# Altium schematic sheet FPGA_0.SchDoc
size A2; Date: Date; CompanyName: HESSO; Engineer: Name; Address1: Route du Rawyl 47; Address2: 1950 Sion; Address3: Switzerland; ProjectName: Project Name
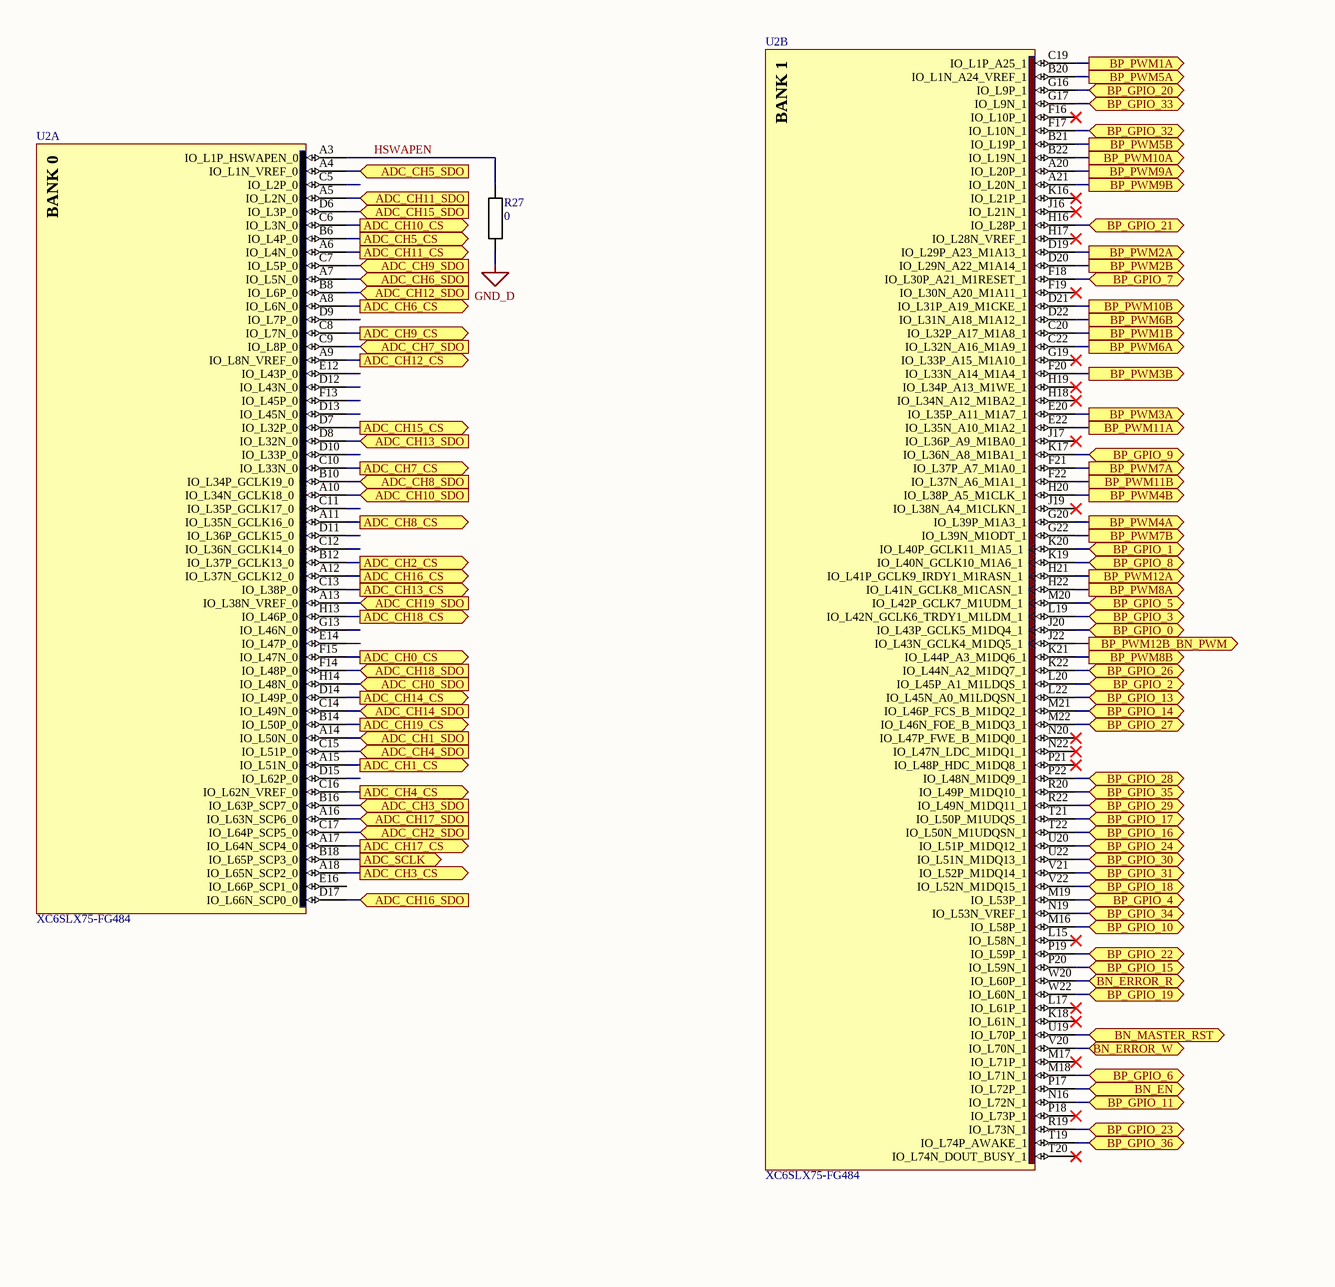
[diagram p0: FPGA_0.SchDoc, left]
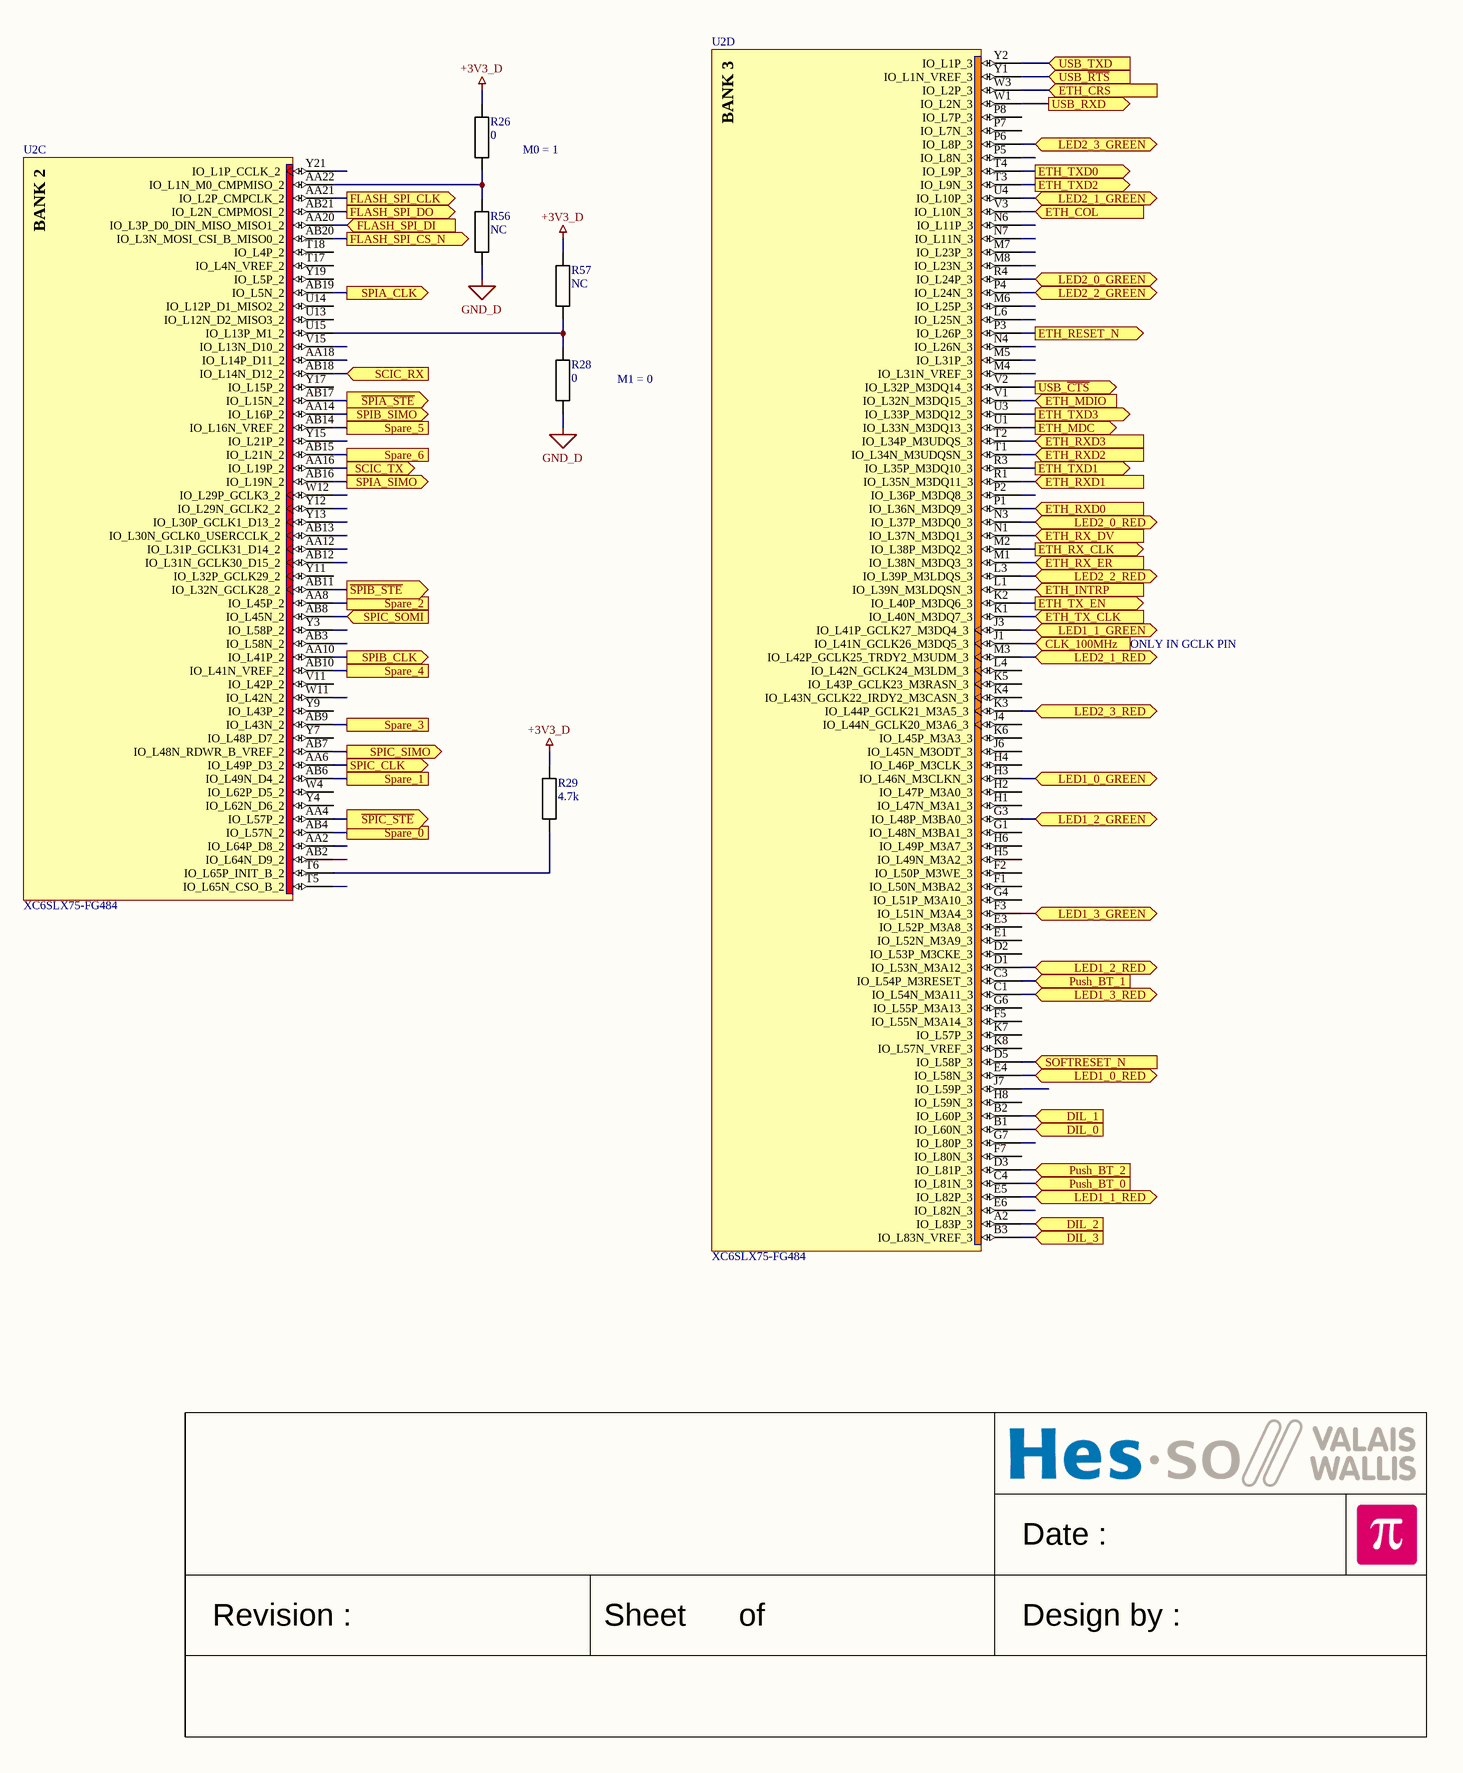
[diagram p1: FPGA_0.SchDoc, right]

## Parts
R26  0  [RESISTOR 2012 REFLOW]
R27  0  [RESISTOR 2012 REFLOW]
R28  0  [RESISTOR 2012 REFLOW]
R29  4.7k  [RESISTOR 2012 REFLOW]
R56  NC  [RESISTOR 2012 REFLOW]
R57  NC  [RESISTOR 2012 REFLOW]
U2  XC6SLX75-FG484  [BGA484 P1.0 C23X23 H2.2]  (parts A,B,C,D of 8)

## Ports
ADC_CH0_CS (out), ADC_CH0_SDO (in), ADC_CH1_CS (out), ADC_CH1_SDO (in), ADC_CH2_CS (out), ADC_CH2_SDO (in), ADC_CH3_CS (out), ADC_CH3_SDO (in), ADC_CH4_CS (out), ADC_CH4_SDO (in), ADC_CH5_CS (out), ADC_CH5_SDO (in), ADC_CH6_CS (out), ADC_CH6_SDO (in), ADC_CH7_CS (out), ADC_CH7_SDO (in), ADC_CH8_CS (out), ADC_CH8_SDO (in), ADC_CH9_CS (out), ADC_CH9_SDO (in), ADC_CH10_CS (out), ADC_CH10_SDO (in), ADC_CH11_CS (out), ADC_CH11_SDO (in), ADC_CH12_CS (out), ADC_CH12_SDO (in), ADC_CH13_CS (out), ADC_CH13_SDO (in), ADC_CH14_CS (out), ADC_CH14_SDO (in), ADC_CH15_CS (out), ADC_CH15_SDO (in), ADC_CH16_CS (out), ADC_CH16_SDO (in), ADC_CH17_CS (out), ADC_CH17_SDO (in), ADC_CH18_CS (out), ADC_CH18_SDO (in), ADC_CH19_CS (out), ADC_CH19_SDO (in), ADC_SCLK (out), BN_EN (bidir), BN_ERROR_R (bidir), BN_ERROR_W (bidir), BN_MASTER_RST (bidir), BP_GPIO_0 (bidir), BP_GPIO_1 (bidir), BP_GPIO_2 (bidir), BP_GPIO_3 (bidir), BP_GPIO_4 (bidir), BP_GPIO_5 (bidir), BP_GPIO_6 (bidir), BP_GPIO_7 (bidir), BP_GPIO_8 (bidir), BP_GPIO_9 (bidir), BP_GPIO_10 (bidir), BP_GPIO_11 (bidir), BP_GPIO_13 (bidir), BP_GPIO_14 (bidir), BP_GPIO_15 (bidir), BP_GPIO_16 (bidir), BP_GPIO_17 (bidir), BP_GPIO_18 (bidir), BP_GPIO_19 (bidir), BP_GPIO_20 (bidir), BP_GPIO_21 (bidir), BP_GPIO_22 (bidir), BP_GPIO_23 (bidir), BP_GPIO_24 (bidir), BP_GPIO_26 (bidir), BP_GPIO_27 (bidir), BP_GPIO_28 (bidir), BP_GPIO_29 (bidir), BP_GPIO_30 (bidir), BP_GPIO_31 (bidir), BP_GPIO_32 (bidir), BP_GPIO_33 (bidir), BP_GPIO_34 (bidir), BP_GPIO_35 (bidir), BP_GPIO_36 (bidir), BP_PWM1A (out), BP_PWM1B (out), BP_PWM2A (out), BP_PWM2B (out), BP_PWM3A (out), BP_PWM3B (out), BP_PWM4A (out), BP_PWM4B (out), BP_PWM5A (out), BP_PWM5B (out), BP_PWM6A (out), BP_PWM6B (out), BP_PWM7A (out), BP_PWM7B (out), BP_PWM8A (out), BP_PWM8B (out), BP_PWM9A (out), BP_PWM9B (out), BP_PWM10A (out), BP_PWM10B (out), BP_PWM11A (out), BP_PWM11B (out), BP_PWM12A (out), BP_PWM12B_BN_PWM (out), CLK_100MHz (in), DIL_0 (in), DIL_1 (in), DIL_2 (in), DIL_3 (in), ETH_COL (in), ETH_CRS (in), ETH_INTRP (in), ETH_MDC (out), ETH_MDIO (in), ETH_RESET_N (out), ETH_RX_CLK (out), ETH_RX_DV (in), ETH_RX_ER (in), ETH_RXD0 (in), ETH_RXD1 (in), ETH_RXD2 (in), ETH_RXD3 (in), ETH_TX_CLK (in), ETH_TX_EN (out), ETH_TXD0 (out), ETH_TXD1 (out), ETH_TXD2 (out), ETH_TXD3 (out), FLASH_SPI_CLK (out), FLASH_SPI_CS_N (out), FLASH_SPI_DI (in), FLASH_SPI_DO (out), LED1_0_GREEN (bidir), LED1_0_RED (bidir), LED1_1_GREEN (bidir), LED1_1_RED (bidir), LED1_2_GREEN (bidir), LED1_2_RED (bidir), LED1_3_GREEN (bidir), LED1_3_RED (bidir), LED2_0_GREEN (bidir), LED2_0_RED (bidir), LED2_1_GREEN (bidir), LED2_1_RED (bidir), LED2_2_GREEN (bidir), LED2_2_RED (bidir), LED2_3_GREEN (bidir), LED2_3_RED (bidir), Push_BT_0 (in), Push_BT_1 (in), Push_BT_2 (in), SCIC_RX (in), SCIC_TX (out), SOFTRESET_N (in), Spare_0, Spare_1, Spare_2, Spare_3, Spare_4, Spare_5, Spare_6, SPIA_CLK (out), SPIA_SIMO (out), SPIB_CLK (out), SPIB_SIMO (out), SPIC_CLK (out), SPIC_SIMO (out), SPIC_SOMI (in), USB_RXD (out), USB_TXD (in), USB_~{CTS} (out), USB_~{RTS} (in), ~{SPIA_STE} (out), ~{SPIB_STE} (out), ~{SPIC_STE} (out)

## Nets
+3V3_D: R26.2 R29.2 R57.2
GND_D: R27.1 R28.1 R56.1
~{SPIA_STE}: U2.AB17(IO_L15N_2) ; port ~{SPIA_STE}
~{SPIB_STE}: U2.AB11(IO_L32N_GCLK28_2) ; port ~{SPIB_STE}
~{SPIC_STE}: U2.AA4(IO_L57P_2) ; port ~{SPIC_STE}
ADC_CH0_CS: U2.F15(IO_L47N_0) ; port ADC_CH0_CS
ADC_CH0_SDO: U2.H14(IO_L48N_0) ; port ADC_CH0_SDO
ADC_CH1_CS: U2.A15(IO_L51N_0) ; port ADC_CH1_CS
ADC_CH1_SDO: U2.A14(IO_L50N_0) ; port ADC_CH1_SDO
ADC_CH2_CS: U2.B12(IO_L37P_GCLK13_0) ; port ADC_CH2_CS
ADC_CH2_SDO: U2.C17(IO_L64P_SCP5_0) ; port ADC_CH2_SDO
ADC_CH3_CS: U2.A18(IO_L65N_SCP2_0) ; port ADC_CH3_CS
ADC_CH3_SDO: U2.B16(IO_L63P_SCP7_0) ; port ADC_CH3_SDO
ADC_CH4_CS: U2.C16(IO_L62N_VREF_0) ; port ADC_CH4_CS
ADC_CH4_SDO: U2.C15(IO_L51P_0) ; port ADC_CH4_SDO
ADC_CH5_CS: U2.B6(IO_L4P_0) ; port ADC_CH5_CS
ADC_CH5_SDO: U2.A4(IO_L1N_VREF_0) ; port ADC_CH5_SDO
ADC_CH6_CS: U2.A8(IO_L6N_0) ; port ADC_CH6_CS
ADC_CH6_SDO: U2.A7(IO_L5N_0) ; port ADC_CH6_SDO
ADC_CH7_CS: U2.C10(IO_L33N_0) ; port ADC_CH7_CS
ADC_CH7_SDO: U2.C9(IO_L8P_0) ; port ADC_CH7_SDO
ADC_CH8_CS: U2.A11(IO_L35N_GCLK16_0) ; port ADC_CH8_CS
ADC_CH8_SDO: U2.B10(IO_L34P_GCLK19_0) ; port ADC_CH8_SDO
ADC_CH9_CS: U2.C8(IO_L7N_0) ; port ADC_CH9_CS
ADC_CH9_SDO: U2.C7(IO_L5P_0) ; port ADC_CH9_SDO
ADC_CH10_CS: U2.C6(IO_L3N_0) ; port ADC_CH10_CS
ADC_CH10_SDO: U2.A10(IO_L34N_GCLK18_0) ; port ADC_CH10_SDO
ADC_CH11_CS: U2.A6(IO_L4N_0) ; port ADC_CH11_CS
ADC_CH11_SDO: U2.A5(IO_L2N_0) ; port ADC_CH11_SDO
ADC_CH12_CS: U2.A9(IO_L8N_VREF_0) ; port ADC_CH12_CS
ADC_CH12_SDO: U2.B8(IO_L6P_0) ; port ADC_CH12_SDO
ADC_CH13_CS: U2.C13(IO_L38P_0) ; port ADC_CH13_CS
ADC_CH13_SDO: U2.D8(IO_L32N_0) ; port ADC_CH13_SDO
ADC_CH14_CS: U2.D14(IO_L49P_0) ; port ADC_CH14_CS
ADC_CH14_SDO: U2.C14(IO_L49N_0) ; port ADC_CH14_SDO
ADC_CH15_CS: U2.D7(IO_L32P_0) ; port ADC_CH15_CS
ADC_CH15_SDO: U2.D6(IO_L3P_0) ; port ADC_CH15_SDO
ADC_CH16_CS: U2.A12(IO_L37N_GCLK12_0) ; port ADC_CH16_CS
ADC_CH16_SDO: U2.D17(IO_L66N_SCP0_0) ; port ADC_CH16_SDO
ADC_CH17_CS: U2.A17(IO_L64N_SCP4_0) ; port ADC_CH17_CS
ADC_CH17_SDO: U2.A16(IO_L63N_SCP6_0) ; port ADC_CH17_SDO
ADC_CH18_CS: U2.H13(IO_L46P_0) ; port ADC_CH18_CS
ADC_CH18_SDO: U2.F14(IO_L48P_0) ; port ADC_CH18_SDO
ADC_CH19_CS: U2.B14(IO_L50P_0) ; port ADC_CH19_CS
ADC_CH19_SDO: U2.A13(IO_L38N_VREF_0) ; port ADC_CH19_SDO
ADC_SCLK: U2.B18(IO_L65P_SCP3_0) ; port ADC_SCLK
BN_EN: U2.P17(IO_L72P_1) ; port BN_EN
BN_ERROR_R: U2.W20(IO_L60P_1) ; port BN_ERROR_R
BN_ERROR_W: U2.V20(IO_L70N_1) ; port BN_ERROR_W
BN_MASTER_RST: U2.U19(IO_L70P_1) ; port BN_MASTER_RST
BP_GPIO_0: U2.J20(IO_L43P_GCLK5_M1DQ4_1) ; port BP_GPIO_0
BP_GPIO_1: U2.K20(IO_L40P_GCLK11_M1A5_1) ; port BP_GPIO_1
BP_GPIO_2: U2.L20(IO_L45P_A1_M1LDQS_1) ; port BP_GPIO_2
BP_GPIO_3: U2.L19(IO_L42N_GCLK6_TRDY1_M1LDM_1) ; port BP_GPIO_3
BP_GPIO_4: U2.M19(IO_L53P_1) ; port BP_GPIO_4
BP_GPIO_5: U2.M20(IO_L42P_GCLK7_M1UDM_1) ; port BP_GPIO_5
BP_GPIO_6: U2.M18(IO_L71N_1) ; port BP_GPIO_6
BP_GPIO_7: U2.F18(IO_L30P_A21_M1RESET_1) ; port BP_GPIO_7
BP_GPIO_8: U2.K19(IO_L40N_GCLK10_M1A6_1) ; port BP_GPIO_8
BP_GPIO_9: U2.K17(IO_L36N_A8_M1BA1_1) ; port BP_GPIO_9
BP_GPIO_10: U2.M16(IO_L58P_1) ; port BP_GPIO_10
BP_GPIO_11: U2.N16(IO_L72N_1) ; port BP_GPIO_11
BP_GPIO_13: U2.L22(IO_L45N_A0_M1LDQSN_1) ; port BP_GPIO_13
BP_GPIO_14: U2.M21(IO_L46P_FCS_B_M1DQ2_1) ; port BP_GPIO_14
BP_GPIO_15: U2.P20(IO_L59N_1) ; port BP_GPIO_15
BP_GPIO_16: U2.T22(IO_L50N_M1UDQSN_1) ; port BP_GPIO_16
BP_GPIO_17: U2.T21(IO_L50P_M1UDQS_1) ; port BP_GPIO_17
BP_GPIO_18: U2.V22(IO_L52N_M1DQ15_1) ; port BP_GPIO_18
BP_GPIO_19: U2.W22(IO_L60N_1) ; port BP_GPIO_19
BP_GPIO_20: U2.G16(IO_L9P_1) ; port BP_GPIO_20
BP_GPIO_21: U2.H16(IO_L28P_1) ; port BP_GPIO_21
BP_GPIO_22: U2.P19(IO_L59P_1) ; port BP_GPIO_22
BP_GPIO_23: U2.R19(IO_L73N_1) ; port BP_GPIO_23
BP_GPIO_24: U2.U20(IO_L51P_M1DQ12_1) ; port BP_GPIO_24
BP_GPIO_26: U2.K22(IO_L44N_A2_M1DQ7_1) ; port BP_GPIO_26
BP_GPIO_27: U2.M22(IO_L46N_FOE_B_M1DQ3_1) ; port BP_GPIO_27
BP_GPIO_28: U2.P22(IO_L48N_M1DQ9_1) ; port BP_GPIO_28
BP_GPIO_29: U2.R22(IO_L49N_M1DQ11_1) ; port BP_GPIO_29
BP_GPIO_30: U2.U22(IO_L51N_M1DQ13_1) ; port BP_GPIO_30
BP_GPIO_31: U2.V21(IO_L52P_M1DQ14_1) ; port BP_GPIO_31
BP_GPIO_32: U2.F17(IO_L10N_1) ; port BP_GPIO_32
BP_GPIO_33: U2.G17(IO_L9N_1) ; port BP_GPIO_33
BP_GPIO_34: U2.N19(IO_L53N_VREF_1) ; port BP_GPIO_34
BP_GPIO_35: U2.R20(IO_L49P_M1DQ10_1) ; port BP_GPIO_35
BP_GPIO_36: U2.T19(IO_L74P_AWAKE_1) ; port BP_GPIO_36
BP_PWM1A: U2.C19(IO_L1P_A25_1) ; port BP_PWM1A
BP_PWM1B: U2.C20(IO_L32P_A17_M1A8_1) ; port BP_PWM1B
BP_PWM2A: U2.D19(IO_L29P_A23_M1A13_1) ; port BP_PWM2A
BP_PWM2B: U2.D20(IO_L29N_A22_M1A14_1) ; port BP_PWM2B
BP_PWM3A: U2.E20(IO_L35P_A11_M1A7_1) ; port BP_PWM3A
BP_PWM3B: U2.F20(IO_L33N_A14_M1A4_1) ; port BP_PWM3B
BP_PWM4A: U2.G20(IO_L39P_M1A3_1) ; port BP_PWM4A
BP_PWM4B: U2.H20(IO_L38P_A5_M1CLK_1) ; port BP_PWM4B
BP_PWM5A: U2.B20(IO_L1N_A24_VREF_1) ; port BP_PWM5A
BP_PWM5B: U2.B21(IO_L19P_1) ; port BP_PWM5B
BP_PWM6A: U2.C22(IO_L32N_A16_M1A9_1) ; port BP_PWM6A
BP_PWM6B: U2.D22(IO_L31N_A18_M1A12_1) ; port BP_PWM6B
BP_PWM7A: U2.F21(IO_L37P_A7_M1A0_1) ; port BP_PWM7A
BP_PWM7B: U2.G22(IO_L39N_M1ODT_1) ; port BP_PWM7B
BP_PWM8A: U2.H22(IO_L41N_GCLK8_M1CASN_1) ; port BP_PWM8A
BP_PWM8B: U2.K21(IO_L44P_A3_M1DQ6_1) ; port BP_PWM8B
BP_PWM9A: U2.A20(IO_L20P_1) ; port BP_PWM9A
BP_PWM9B: U2.A21(IO_L20N_1) ; port BP_PWM9B
BP_PWM10A: U2.B22(IO_L19N_1) ; port BP_PWM10A
BP_PWM10B: U2.D21(IO_L31P_A19_M1CKE_1) ; port BP_PWM10B
BP_PWM11A: U2.E22(IO_L35N_A10_M1A2_1) ; port BP_PWM11A
BP_PWM11B: U2.F22(IO_L37N_A6_M1A1_1) ; port BP_PWM11B
BP_PWM12A: U2.H21(IO_L41P_GCLK9_IRDY1_M1RASN_1) ; port BP_PWM12A
BP_PWM12B_BN_PWM: U2.J22(IO_L43N_GCLK4_M1DQ5_1) ; port BP_PWM12B_BN_PWM
CLK_100MHz: U2.J1(IO_L41N_GCLK26_M3DQ5_3) ; port CLK_100MHz
DIL_0: U2.B1(IO_L60N_3) ; port DIL_0
DIL_1: U2.B2(IO_L60P_3) ; port DIL_1
DIL_2: U2.A2(IO_L83P_3) ; port DIL_2
DIL_3: U2.B3(IO_L83N_VREF_3) ; port DIL_3
ETH_COL: U2.V3(IO_L10N_3) ; port ETH_COL
ETH_CRS: U2.W3(IO_L2P_3) ; port ETH_CRS
ETH_INTRP: U2.L1(IO_L39N_M3LDQSN_3) ; port ETH_INTRP
ETH_MDC: U2.U1(IO_L33N_M3DQ13_3) ; port ETH_MDC
ETH_MDIO: U2.V1(IO_L32N_M3DQ15_3) ; port ETH_MDIO
ETH_RESET_N: U2.P3(IO_L26P_3) ; port ETH_RESET_N
ETH_RX_CLK: U2.M2(IO_L38P_M3DQ2_3) ; port ETH_RX_CLK
ETH_RX_DV: U2.N1(IO_L37N_M3DQ1_3) ; port ETH_RX_DV
ETH_RX_ER: U2.M1(IO_L38N_M3DQ3_3) ; port ETH_RX_ER
ETH_RXD0: U2.P1(IO_L36N_M3DQ9_3) ; port ETH_RXD0
ETH_RXD1: U2.R1(IO_L35N_M3DQ11_3) ; port ETH_RXD1
ETH_RXD2: U2.T1(IO_L34N_M3UDQSN_3) ; port ETH_RXD2
ETH_RXD3: U2.T2(IO_L34P_M3UDQS_3) ; port ETH_RXD3
ETH_TX_CLK: U2.K1(IO_L40N_M3DQ7_3) ; port ETH_TX_CLK
ETH_TX_EN: U2.K2(IO_L40P_M3DQ6_3) ; port ETH_TX_EN
ETH_TXD0: U2.T4(IO_L9P_3) ; port ETH_TXD0
ETH_TXD1: U2.R3(IO_L35P_M3DQ10_3) ; port ETH_TXD1
ETH_TXD2: U2.T3(IO_L9N_3) ; port ETH_TXD2
ETH_TXD3: U2.U3(IO_L33P_M3DQ12_3) ; port ETH_TXD3
FLASH_SPI_CLK: U2.AA21(IO_L2P_CMPCLK_2) ; port FLASH_SPI_CLK
FLASH_SPI_CS_N: U2.AB20(IO_L3N_MOSI_CSI_B_MISO0_2) ; port FLASH_SPI_CS_N
FLASH_SPI_DI: U2.AA20(IO_L3P_D0_DIN_MISO_MISO1_2) ; port FLASH_SPI_DI
FLASH_SPI_DO: U2.AB21(IO_L2N_CMPMOSI_2) ; port FLASH_SPI_DO
HSWAPEN: R27.2 U2.A3(IO_L1P_HSWAPEN_0)
LED1_0_GREEN: U2.H3(IO_L46N_M3CLKN_3) ; port LED1_0_GREEN
LED1_0_RED: U2.E4(IO_L58N_3) ; port LED1_0_RED
LED1_1_GREEN: U2.J3(IO_L41P_GCLK27_M3DQ4_3) ; port LED1_1_GREEN
LED1_1_RED: U2.E5(IO_L82P_3) ; port LED1_1_RED
LED1_2_GREEN: U2.G3(IO_L48P_M3BA0_3) ; port LED1_2_GREEN
LED1_2_RED: U2.D1(IO_L53N_M3A12_3) ; port LED1_2_RED
LED1_3_GREEN: U2.F3(IO_L51N_M3A4_3) ; port LED1_3_GREEN
LED1_3_RED: U2.C1(IO_L54N_M3A11_3) ; port LED1_3_RED
LED2_0_GREEN: U2.R4(IO_L24P_3) ; port LED2_0_GREEN
LED2_0_RED: U2.N3(IO_L37P_M3DQ0_3) ; port LED2_0_RED
LED2_1_GREEN: U2.U4(IO_L10P_3) ; port LED2_1_GREEN
LED2_1_RED: U2.M3(IO_L42P_GCLK25_TRDY2_M3UDM_3) ; port LED2_1_RED
LED2_2_GREEN: U2.P4(IO_L24N_3) ; port LED2_2_GREEN
LED2_2_RED: U2.L3(IO_L39P_M3LDQS_3) ; port LED2_2_RED
LED2_3_GREEN: U2.P6(IO_L8P_3) ; port LED2_3_GREEN
LED2_3_RED: U2.K3(IO_L44P_GCLK21_M3A5_3) ; port LED2_3_RED
Push_BT_0: U2.C4(IO_L81N_3) ; port Push_BT_0
Push_BT_1: U2.C3(IO_L54P_M3RESET_3) ; port Push_BT_1
Push_BT_2: U2.D3(IO_L81P_3) ; port Push_BT_2
SCIC_RX: U2.AB18(IO_L14N_D12_2) ; port SCIC_RX
SCIC_TX: U2.AA16(IO_L19P_2) ; port SCIC_TX
SOFTRESET_N: U2.D5(IO_L58P_3) ; port SOFTRESET_N
Spare_0: U2.AB4(IO_L57N_2) ; port Spare_0
Spare_1: U2.AB6(IO_L49N_D4_2) ; port Spare_1
Spare_2: U2.AA8(IO_L45P_2) ; port Spare_2
Spare_3: U2.AB9(IO_L43N_2) ; port Spare_3
Spare_4: U2.AB10(IO_L41N_VREF_2) ; port Spare_4
Spare_5: U2.AB14(IO_L16N_VREF_2) ; port Spare_5
Spare_6: U2.AB15(IO_L21N_2) ; port Spare_6
SPIA_CLK: U2.AB19(IO_L5N_2) ; port SPIA_CLK
SPIA_SIMO: U2.AB16(IO_L19N_2) ; port SPIA_SIMO
SPIB_CLK: U2.AA10(IO_L41P_2) ; port SPIB_CLK
SPIB_SIMO: U2.AA14(IO_L16P_2) ; port SPIB_SIMO
SPIC_CLK: U2.AA6(IO_L49P_D3_2) ; port SPIC_CLK
SPIC_SIMO: U2.AB7(IO_L48N_RDWR_B_VREF_2) ; port SPIC_SIMO
SPIC_SOMI: U2.AB8(IO_L45N_2) ; port SPIC_SOMI
USB_~{CTS}: U2.V2(IO_L32P_M3DQ14_3) ; port USB_~{CTS}
USB_~{RTS}: U2.Y1(IO_L1N_VREF_3) ; port USB_~{RTS}
USB_RXD: U2.W1(IO_L2N_3) ; port USB_RXD
USB_TXD: U2.Y2(IO_L1P_3) ; port USB_TXD
NetR26_1: R26.1 R56.2 U2.AA22(IO_L1N_M0_CMPMISO_2)
NetR28_2: R28.2 R57.1 U2.U15(IO_L13P_M1_2)
NetR29_1: R29.1 U2.T6(IO_L65P_INIT_B_2)

Not connected (* = marked no-connect by the designer): U2 AA2(IO_L64P_D8_2) AA12(IO_L31P_GCLK31_D14_2) AA18(IO_L14P_D11_2) AB2(IO_L64N_D9_2) AB3(IO_L58N_2) AB12(IO_L31N_GCLK30_D15_2) AB13(IO_L30N_GCLK0_USERCCLK_2) C5(IO_L2P_0) C11(IO_L35P_GCLK17_0) C12(IO_L36N_GCLK14_0) D2(IO_L53P_M3CKE_3) D9(IO_L7P_0) D10(IO_L33P_0) D11(IO_L36P_GCLK15_0) D12(IO_L43N_0) D13(IO_L45N_0) D15(IO_L62P_0) E1(IO_L52N_M3A9_3) E3(IO_L52P_M3A8_3) E6(IO_L82N_3) E12(IO_L43P_0) E14(IO_L47P_0) E16(IO_L66P_SCP1_0) F1(IO_L50N_M3BA2_3) F2(IO_L50P_M3WE_3) F5(IO_L55N_M3A14_3) F7(IO_L80N_3) F13(IO_L45P_0) F16(IO_L10P_1)* F19(IO_L30N_A20_M1A11_1)* G1(IO_L48N_M3BA1_3) G4(IO_L51P_M3A10_3) G6(IO_L55P_M3A13_3) G7(IO_L80P_3) G13(IO_L46N_0) G19(IO_L33P_A15_M1A10_1)* H1(IO_L47N_M3A1_3) H2(IO_L47P_M3A0_3) H4(IO_L46P_M3CLK_3) H5(IO_L49N_M3A2_3) H6(IO_L49P_M3A7_3) H8(IO_L59N_3) H17(IO_L28N_VREF_1)* H18(IO_L34N_A12_M1BA2_1)* H19(IO_L34P_A13_M1WE_1)* J4(IO_L44N_GCLK20_M3A6_3) J6(IO_L45N_M3ODT_3) J7(IO_L59P_3) J16(IO_L21N_1)* J17(IO_L36P_A9_M1BA0_1)* J19(IO_L38N_A4_M1CLKN_1)* K4(IO_L43N_GCLK22_IRDY2_M3CASN_3) K5(IO_L43P_GCLK23_M3RASN_3) K6(IO_L45P_M3A3_3) K7(IO_L57P_3) K8(IO_L57N_VREF_3) K16(IO_L21P_1)* K18(IO_L61N_1)* L4(IO_L42N_GCLK24_M3LDM_3) L6(IO_L25N_3) L15(IO_L58N_1)* L17(IO_L61P_1)* M4(IO_L31N_VREF_3) M5(IO_L31P_3) M6(IO_L25P_3) M7(IO_L23P_3) M8(IO_L23N_3) M17(IO_L71P_1)* N4(IO_L26N_3) N6(IO_L11P_3) N7(IO_L11N_3) N20(IO_L47P_FWE_B_M1DQ0_1)* N22(IO_L47N_LDC_M1DQ1_1)* P2(IO_L36P_M3DQ8_3) P5(IO_L8N_3) P7(IO_L7N_3) P8(IO_L7P_3) P18(IO_L73P_1)* P21(IO_L48P_HDC_M1DQ8_1)* T5(IO_L65N_CSO_B_2) T17(IO_L4N_VREF_2) T18(IO_L4P_2) T20(IO_L74N_DOUT_BUSY_1)* U13(IO_L12N_D2_MISO3_2) U14(IO_L12P_D1_MISO2_2) V11(IO_L42P_2) V15(IO_L13N_D10_2) W4(IO_L62P_D5_2) W11(IO_L42N_2) W12(IO_L29P_GCLK3_2) Y3(IO_L58P_2) Y4(IO_L62N_D6_2) Y7(IO_L48P_D7_2) Y9(IO_L43P_2) Y11(IO_L32P_GCLK29_2) Y12(IO_L29N_GCLK2_2) Y13(IO_L30P_GCLK1_D13_2) Y15(IO_L21P_2) Y17(IO_L15P_2) Y19(IO_L5P_2) Y21(IO_L1P_CCLK_2)

## Notes on the sheet
- (near R26) M0 = 1
- M1 = 0
- ONLY IN GCLK PIN
- Date :
- Revision :
- Sheet
- of
- Design by :
- (in symbol XC6SLX75-FG484, part A) BANK 0
- (in symbol XC6SLX75-FG484, part B) BANK 1
- (in symbol XC6SLX75-FG484, part C) BANK 2
- (in symbol XC6SLX75-FG484, part D) BANK 3

## Library data of the parts
R26-R29 R56 R57 = Resistor: Resistor 1% 50V 125mW 2012(0805)
  R26-R28: Value: 0
  R29: Value: 4.7k
  R56 R57: Value: NC
U2 = XC6SLX75-FG484: Spartan-6 LXT 1.2V FPGA, 268 User I/Os, 484-Ball Fine-Pitch BGA (1.0mm Pitch); Value: XC6SLX75-FG484